# Altium schematic sheet 2-FrontEnd.SchDoc
size A4
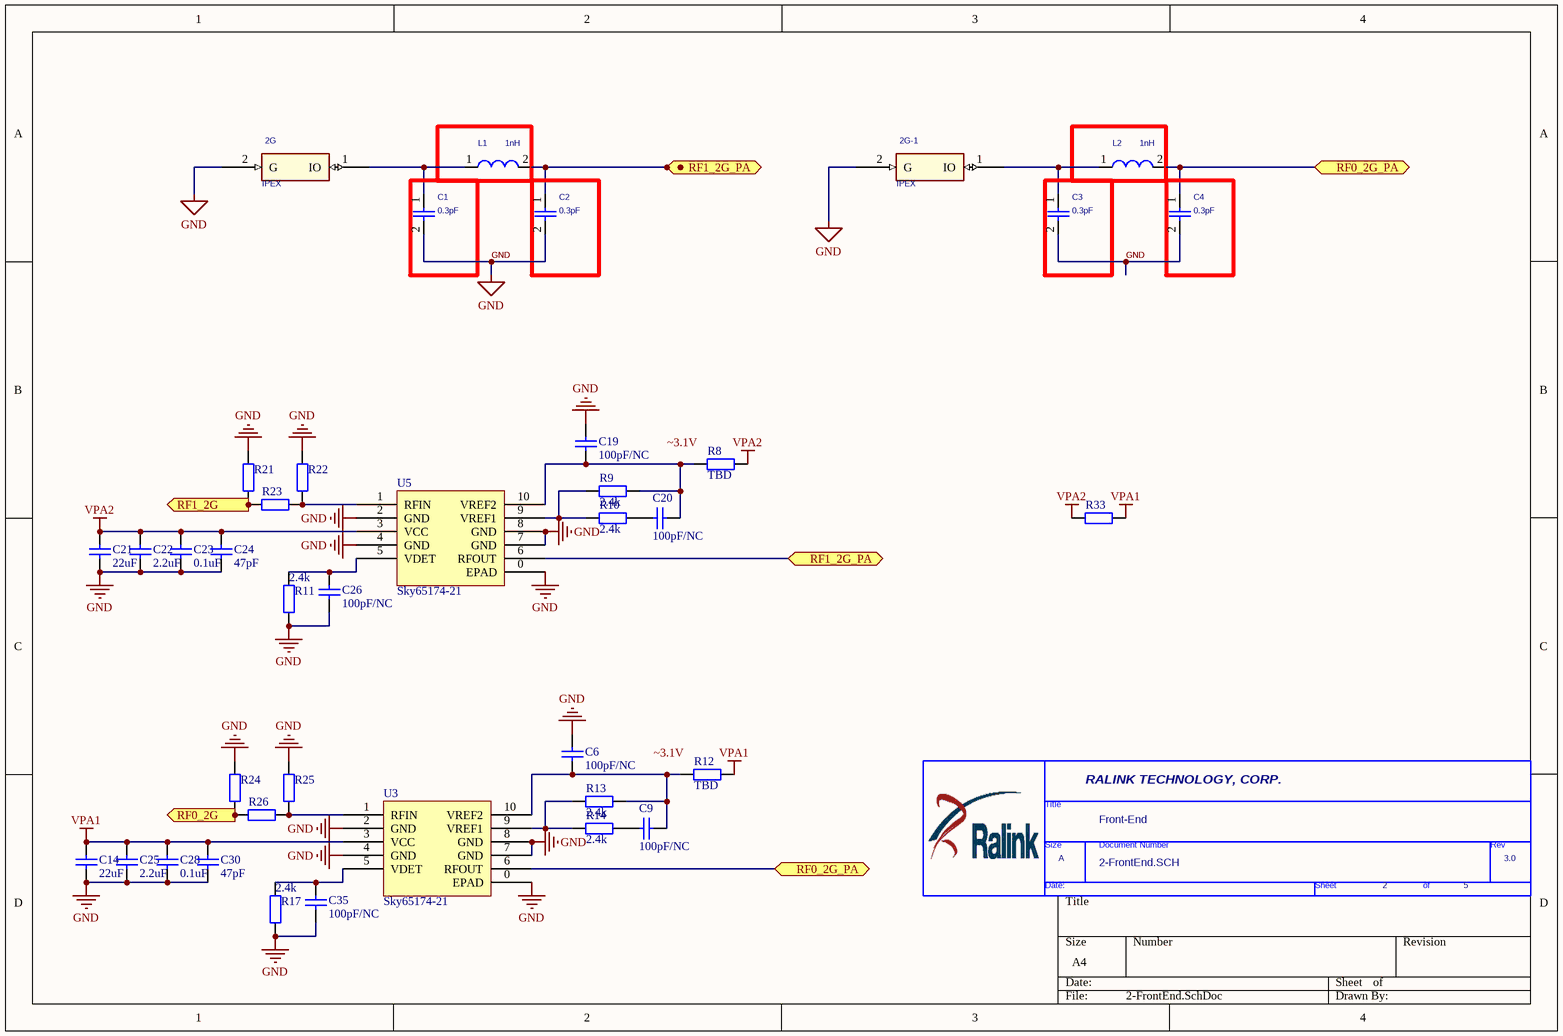
[diagram p0: 2-FrontEnd.SchDoc]

## Parts
2G  IPEX  [IPEX]
2G-1  IPEX  [IPEX]
*  Page Count: 5  Page Number: 2  Page Size: A  OrgName: RALINK TECHNOLOGY, CORP.  Title: Front-End  RevCode: 3.0  Doc: 2-FrontEnd.SCH  (hidden comment: TitleBlock1-RA-new)  (graphical)
C1  0.3pF  [0402]
C2  0.3pF  [0402]
C3  0.3pF  [0402]
C4  0.3pF  [0402]
C6  value 100pF/NC  [0402]  (hidden comment: Cap)
C9  value 100pF/NC  [0402]  (hidden comment: Cap)
C14  value 22uF  [0805]  (hidden comment: Cap)
C19  value 100pF/NC  [0402]  (hidden comment: Cap)
C20  value 100pF/NC  [0402]  (hidden comment: Cap)
C21  value 22uF  [0805]  (hidden comment: Cap)
C22  value 2.2uF  [0603]  (hidden comment: Cap)
C23  value 0.1uF  [0402]  (hidden comment: Cap)
C24  value 47pF  [0402]  (hidden comment: Cap)
C25  value 2.2uF  [0603]  (hidden comment: Cap)
C26  value 100pF/NC  [0402]  (hidden comment: Cap)
C28  value 0.1uF  [0402]  (hidden comment: Cap)
C30  value 47pF  [0402]  (hidden comment: Cap)
C35  value 100pF/NC  [0402]  (hidden comment: Cap)
L1  1nH  [0402]
L2  1nH  [0402]
R8  value TBD  [0402]  (hidden comment: Res2)
R9  value 2.4k  [0402]  (hidden comment: Res2)
R10  value 2.4k  [0402]  (hidden comment: Res2)
R11  value 2.4k  [0402]  (hidden comment: Res2)
R12  value TBD  [0402]  (hidden comment: Res2)
R13  value 2.4k  [0402]  (hidden comment: Res2)
R14  value 2.4k  [0402]  (hidden comment: Res2)
R17  value 2.4k  [0402]  (hidden comment: Res2)
R21  TBD  [0402]  (value not drawn)
R22  TBD  [0402]  (value not drawn)
R23  TBD  [0402]  (value not drawn)
R24  TBD  [0402]  (value not drawn)
R25  TBD  [0402]  (value not drawn)
R26  TBD  [0402]  (value not drawn)
R33  NC/0R  [0402]  (value not drawn)
U3  Sky65174-21  [SKY65174-21]
U5  Sky65174-21  [SKY65174-21]

## Ports
RF0_2G (in), RF0_2G_PA, RF1_2G (in), RF1_2G_PA

## Nets
GND: 2G.2(G) 2G-1.2(G) C1.2 C2.2 C3.2 C4.2 C6.1 C14.2 C19.1 C21.2 C22.2 C23.2 C24.2 C25.2 C26.2 C28.2 C30.2 C35.2 R11.1 R17.1 R21.2 R22.1 R24.1 R25.1 U3.0(EPAD) U3.2(GND) U3.4(GND) U3.7(GND) U3.8(GND) U5.0(EPAD) U5.2(GND) U5.4(GND) U5.7(GND) U5.8(GND)
VPA1: C14.1 C25.1 C28.1 C30.1 R12.1 R33.2 U3.3(VCC)
VPA2: C21.1 C22.1 C23.1 C24.1 R8.1 R33.1 U5.3(VCC)
RF0_2G: R24.2 R26.1 ; port RF0_2G
RF0_2G_PA: C4.1 L2.2 U3.6(RFOUT) ; port RF0_2G_PA
RF1_2G: R21.1 R23.1 ; port RF1_2G
RF1_2G_PA: C2.1 L1.2 U5.6(RFOUT) ; port RF1_2G_PA
Net2G-1_1: 2G-1.1(IO) C3.1 L2.1
Net2G_1: 2G.1(IO) C1.1 L1.1
NetC6_2: C6.2 C9.2 R12.2 R13.1 U3.10(VREF2)
NetC9_1: C9.1 R14.1
NetC19_2: C19.2 C20.2 R8.2 R9.1 U5.10(VREF2)
NetC20_1: C20.1 R10.1
NetC26_1: C26.1 R11.2 U5.5(VDET)
NetC35_1: C35.1 R17.2 U3.5(VDET)
NetR9_2: R9.2 R10.2 U5.9(VREF1)
NetR13_2: R13.2 R14.2 U3.9(VREF1)
NetR22_2: R22.2 R23.2 U5.1(RFIN)
NetR25_2: R25.2 R26.2 U3.1(RFIN)

## Notes on the sheet
- Labels drawn without touching a wire or pin: ~3.1V
- (in symbol TitleBlock1-RA-new) Title; Size; Document Number; Rev; Date:; Sheet; of

## Library data of the parts
2G 2G-1 = ANT-RA-USB-1
C1-C4 = CAP/0402
C6 C9 C14 C19-C26 C28 C30 C35 = Cap: Capacitor; Published: 8-Jun-2000; LatestRevisionDate: 17-Jul-2002; LatestRevisionNote: Re-released for DXP Platform.; PackageReference: RAD-0.3; Publisher: Altium Limited; PackageDescription: Radial Cap, Thru-Hole; 2 Leads; 0.3 in Pin Spacing
L1 L2 = L/0402
R8-R14 R17 R21-R26 R33 = Res2: Resistor; Published: 8-Jun-2000; LatestRevisionDate: 17-Jul-2002; LatestRevisionNote: Re-released for DXP Platform.; PackageReference: AXIAL-0.4; Publisher: Altium Limited; PackageDescription: Axial Device, Thru-Hole; 2 Leads; 0.4 in Pin Spacing
* = TitleBlock1-RA-new: Page Create Date: March  8, 1995